# EAGLE design PillEndo-Proto_SW (EAGLE 6.5.0)
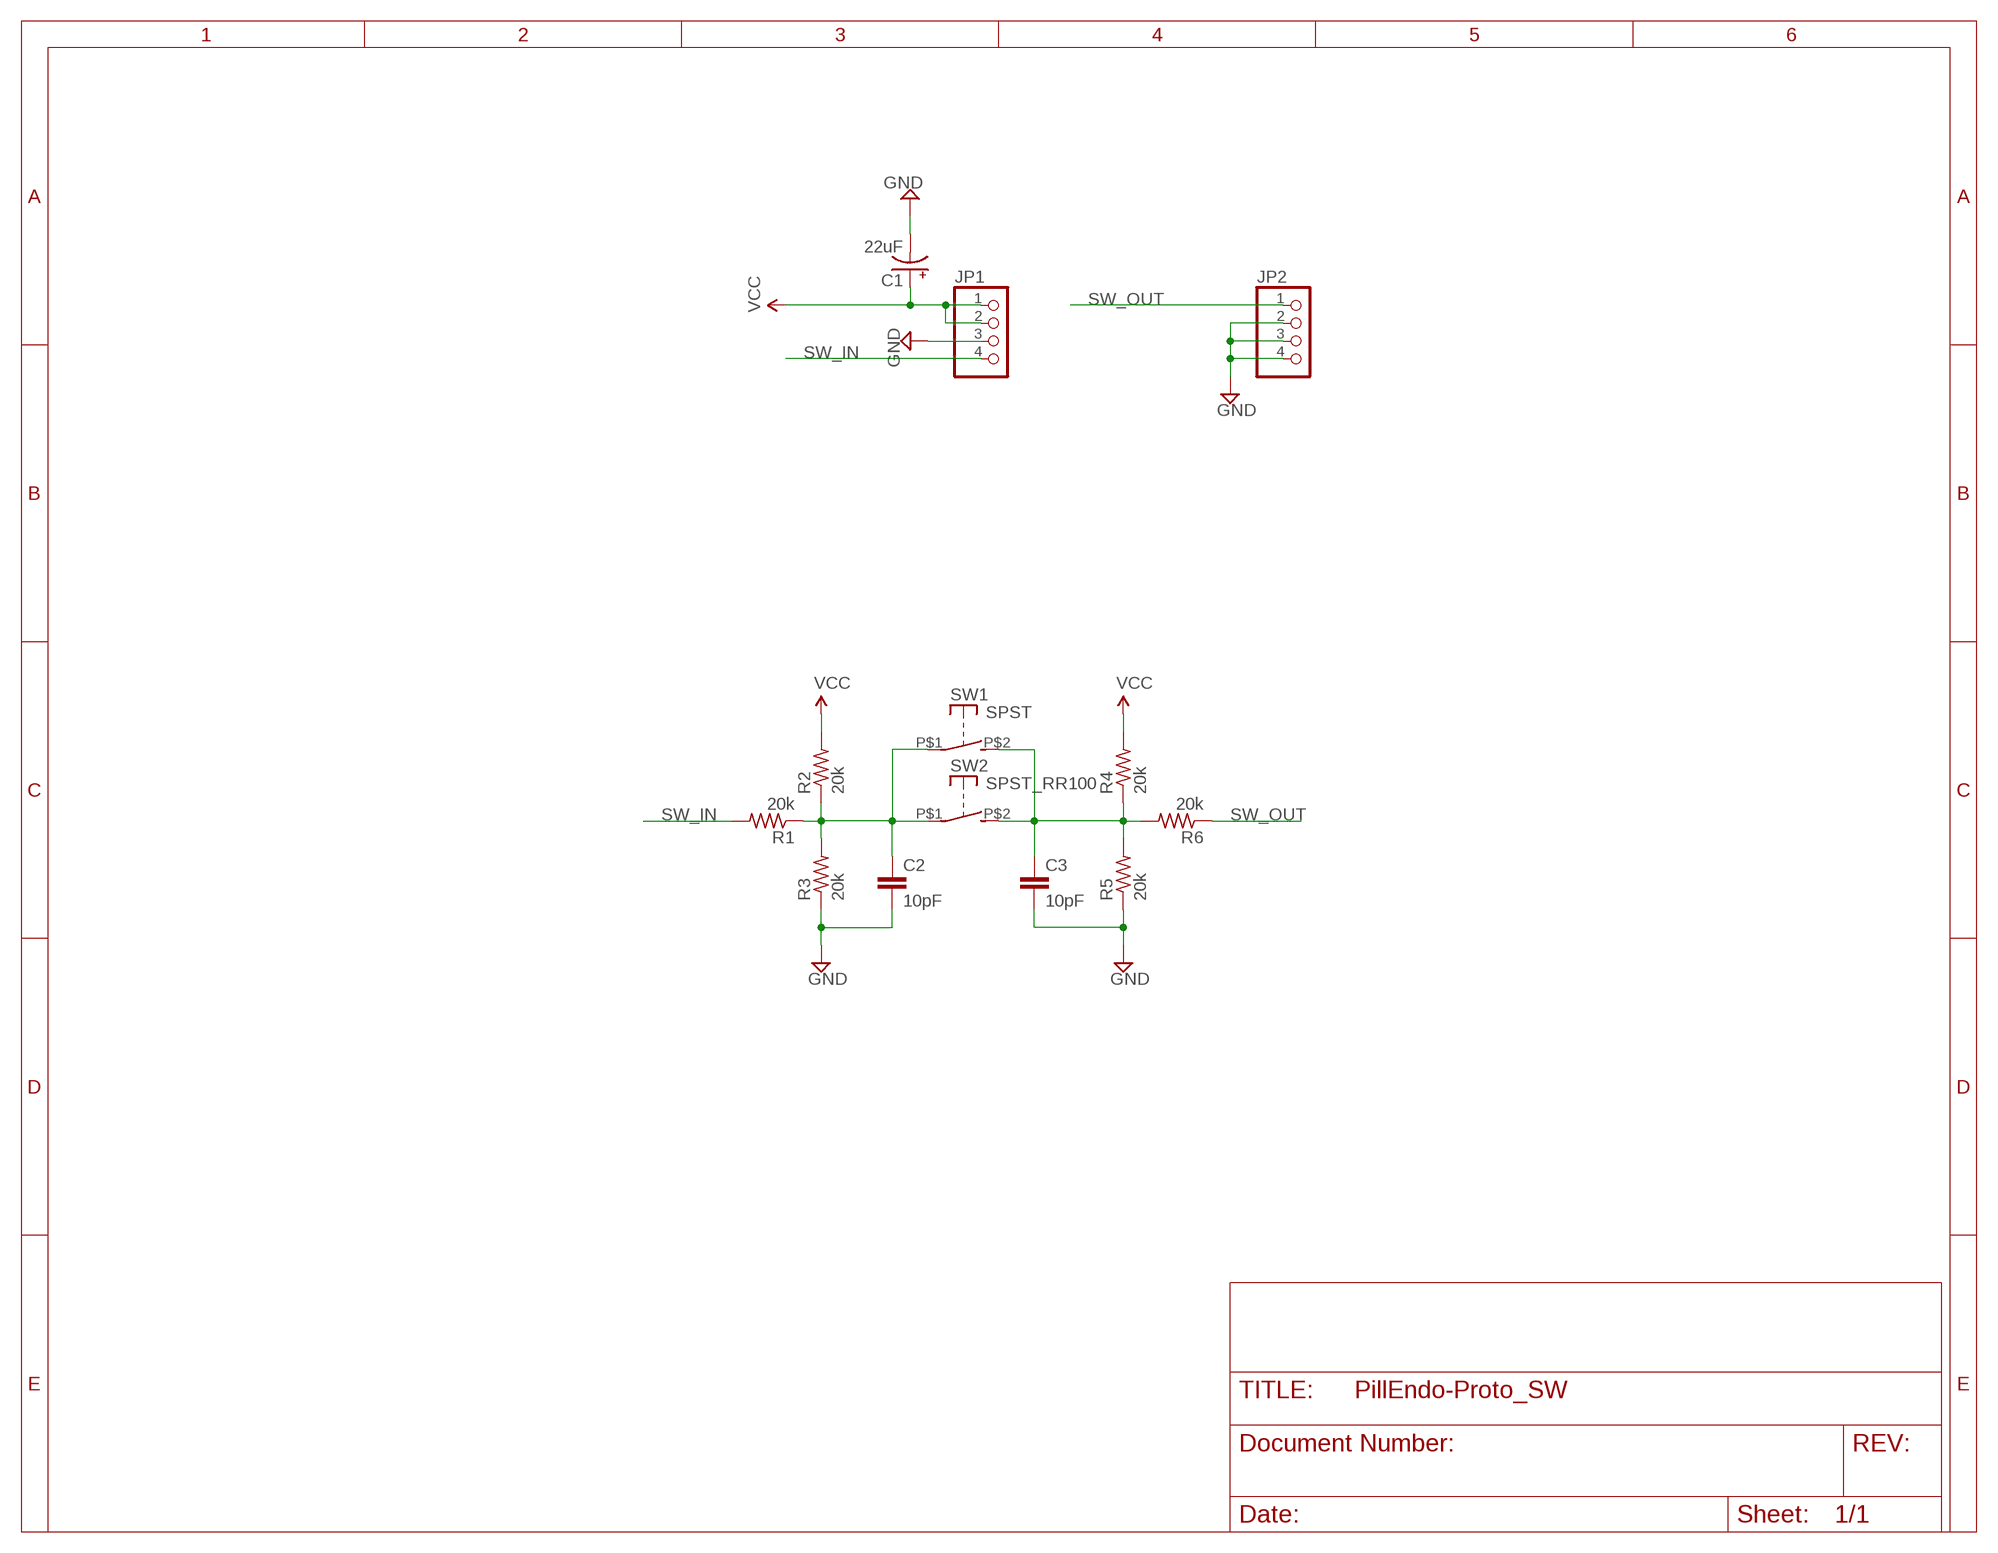
[diagram p0: schematic, sheet 1]

## Parts
C1  22uF  CPOL-USCT3216  [CT3216]
C2  10pF  C-EUC0603  [C0603]
C3  10pF  C-EUC0603  [C0603]
JP1  PINHD-1X4  [1X04]
JP2  PINHD-1X4  [1X04]
R1  20k  R-US_R0603  [R0603]
R2  20k  R-US_R0603  [R0603]
R3  20k  R-US_R0603  [R0603]
R4  20k  R-US_R0603  [R0603]
R5  20k  R-US_R0603  [R0603]
R6  20k  R-US_R0603  [R0603]
SW1  SPST  [CT05]
SW2  SPST_RR100  [RR100]

## Nets
GND: C1.- C2.2 C3.2 JP1.3 JP2.2 JP2.3 JP2.4 R3.1 R5.1
N$1: C3.1 R4.1 R5.2 R6.2 SW1.P$2(S) SW2.P$2(S)
N$2: C2.1 R1.1 R2.1 R3.2 SW1.P$1(P) SW2.P$1(P)
SW_IN: JP1.4 R1.2
SW_OUT: JP2.1 R6.1
VCC: C1.+ JP1.1 JP1.2 R2.2 R4.2

## Library data of the parts
C1 = rcl:CPOL-US: POLARIZED CAPACITOR, American symbol
C2 C3 = rcl:C-EU: CAPACITOR, European symbol
JP1 JP2 = pinhead:PINHD-1X4: PIN HEADER
R1-R6 = rcl:R-US_: RESISTOR, American symbol
SW1 SW2 = MSSRP-Lib:SPST

## Board
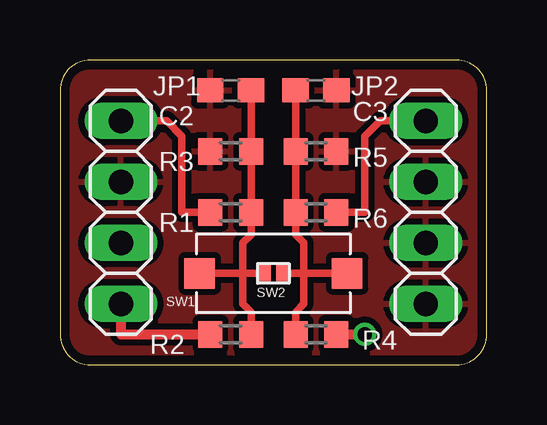
[diagram p1: board, top side]
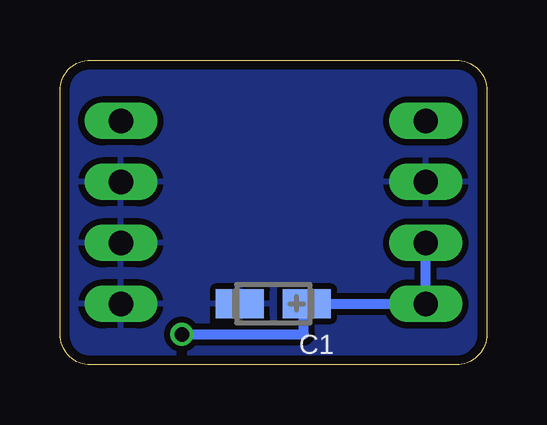
[diagram p2: board, bottom side, seen from below]

Size 17.78 x 12.7 mm. Coordinates in mm from the lower left corner, seen from the top.
Outline: 1.27,0 16.51,0 arc90 17.78,1.27 17.78,11.43 arc90 16.51,12.7 1.27,12.7 arc90 0,11.43 0,1.27 arc90 1.27,0
Copper layers (1*16): Top 0.0356mm / dielectric 1.5011mm / Bottom 0.0356mm
Design rules "LaenPCBOrder": minimum track width 6mil, minimum drill 13mil, track to track 6mil, track to pad 6mil, pad to pad 6mil, via to via 6mil, smd to smd 6mil, copper to edge 15mil, drill to drill 6mil, minimum pad ring 7mil, minimum via ring 7mil, stop-mask expansion 3mil, vias tented up to drill 0mil, thermal gap 10mil

### Footprints (pad centres in the part's own frame; a part is rotated, then mirrored left to right if it is on the bottom)
CT3216 = smd 2 x 1.2: + -1.4,0; - 1.4,0
C0603 = smd 1.1 x 1: 1 -0.85,0; 2 0.85,0
1X04 = drill 1.016 long: 1 -3.81,0; 2 -1.27,0; 3 1.27,0; 4 3.81,0
R0603 = smd 1 x 1.1: 1 -0.85,0; 2 0.85,0
CT05 = smd 1.27 x 1.27: P$1 -3.075,0; P$2 3.075,0
RR100 = smd 0.55 x 0.8: P$1 -0.372,0; P$2 0.372,0

### Placement (x,y rotation side)
C1  8.89,2.54 180 bottom
C2  7.11,11.43 180 top
C3  10.67,11.43 0 top
JP1  2.54,6.35 90 top
JP2  15.24,6.35 270 top
R1  7.11,6.35 180 top
R2  7.11,1.27 180 top
R3  7.11,8.89 0 top
R4  10.67,1.27 0 top
R5  10.67,8.89 180 top
R6  10.67,6.35 180 top
SW1  8.89,3.81 0 top
SW2  8.89,3.81 0 top

### Tracks (layer width: path | path; a pad name or v marks a point on that pad's centre or on a via)
GND
  pour Bottom (isolate 0.254, rank 6): 0,0 17.78,0 17.78,12.7 0,12.7
  pour Top (isolate 0.254, rank 6): 0,0 17.78,0 17.78,12.7 0,12.7
N$1
  Top 0.305: C3.1 R5.2 R6.2 9.82,5.42 10.16,5.08 10.16,3.81 | SW2.P$2 10.16,3.81 | 10.16,3.81 SW1.P$2 | R4.1 9.82,2.2 10.16,2.54 10.16,3.81
N$2
  Top 0.305: C2.1 R3.2 R1.1 7.96,5.42 7.62,5.08 7.62,3.81 | SW2.P$1 7.62,3.81 | 7.62,3.81 SW1.P$1 | R2.1 7.96,2.2 7.62,2.54 7.62,3.81
SW_IN
  Top 0.305: JP1.4 4.45,10.16 5.08,9.53 5.08,6.35 R1.2
SW_OUT
  Top 0.305: JP2.1 13.34,10.16 12.7,9.53 12.7,6.35 R6.1
VCC  (via drill 0.6)
  Top 0.406: JP1.1 2.54,1.27 R2.2 | R4.2 v12.7,1.27
  Bottom 0.406: JP1.2 JP1.1 C1.+ 7.62,2.41 7.62,1.27 v12.7,1.27